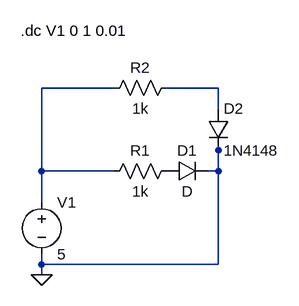
[diagram p0: schematic Diode Comparison 2 in 1.asc]
Diode Comparison 2 in 1.asc, the LTspice schematic file:
Version 4.1
SHEET 1 880 680
WIRE 112 80 0 80
WIRE 272 80 192 80
WIRE 272 112 272 80
WIRE 272 176 272 160
WIRE 0 208 0 80
WIRE 112 208 0 208
WIRE 272 208 272 176
WIRE 272 208 256 208
WIRE 0 256 0 208
WIRE 0 352 0 336
WIRE 272 352 272 208
WIRE 272 352 0 352
WIRE 0 368 0 352
FLAG 0 368 0
SYMBOL res 208 64 R90
WINDOW 0 0 56 VBottom 2
WINDOW 3 32 56 VTop 2
SYMATTR InstName R2
SYMATTR Value 1k
SYMBOL diode 256 112 R0
SYMATTR InstName D2
SYMATTR Value 1N4148
SYMBOL res 208 192 R90
WINDOW 0 0 56 VBottom 2
WINDOW 3 32 56 VTop 2
SYMATTR InstName R1
SYMATTR Value 1k
SYMBOL voltage 0 240 R0
SYMATTR InstName V1
SYMATTR Value 5
SYMBOL diode 192 224 R270
WINDOW 0 32 32 VTop 2
WINDOW 3 0 32 VBottom 2
SYMATTR InstName D1
TEXT -32 -8 Left 2 !.dc V1 0 1 0.01

The netlist it stands for:
* Diode Comparison 2 in 1.asc
R2 N002 N001 1k
D2 N002 0 1N4148
R1 P001 N001 1k
V1 N001 0 5
D1 P001 0 D
.model D D
.lib standard.dio
.dc V1 0 1 0.01
.backanno
.end